# EAGLE design Board (EAGLE 7.5.0)
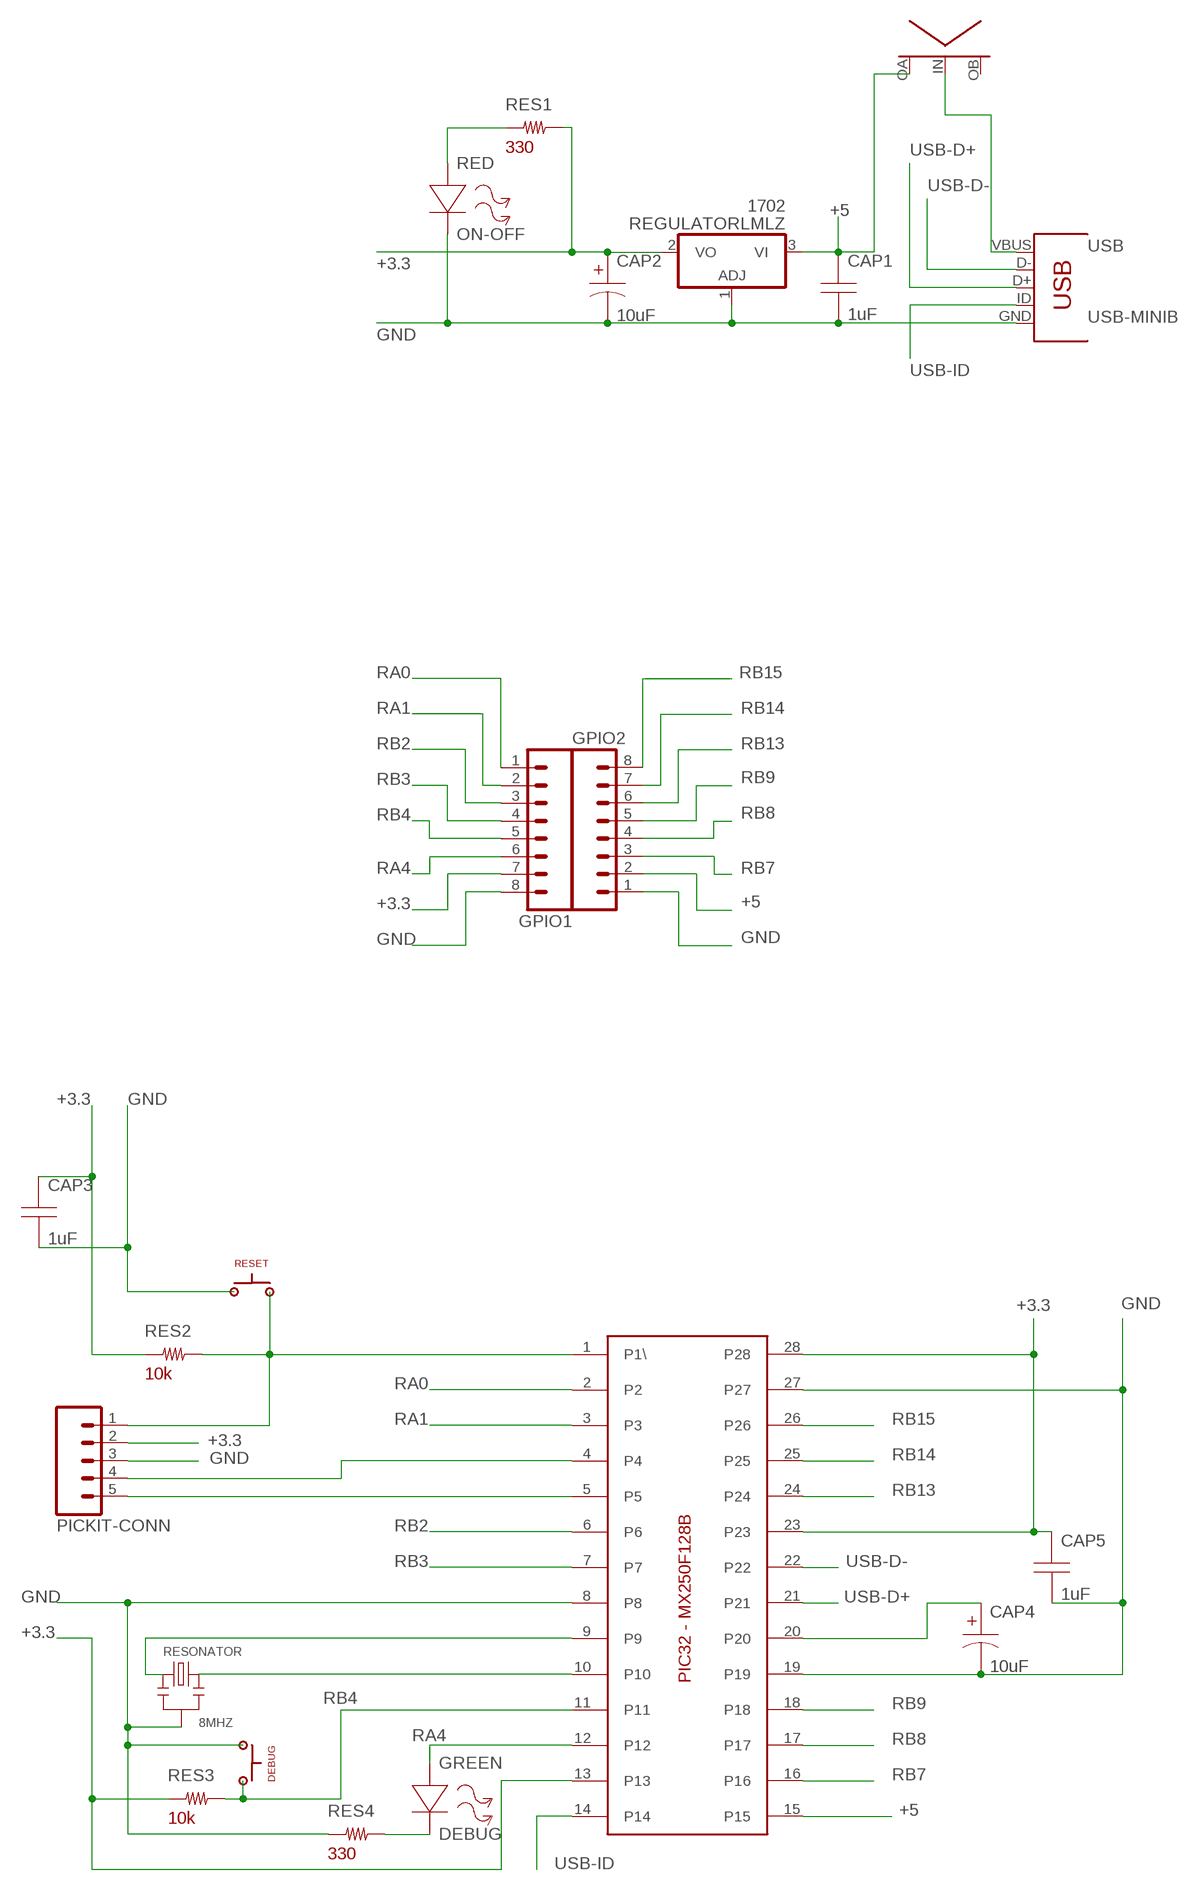
[diagram p0: schematic, sheet 1]

## Parts
1702  REGULATORLMLZ  [TO92]
CAP1  1uF  CAP-CERAMIC  [CAP-CERAMIC]
CAP2  10uF  CAP-TANTALUM  [TT2D4]
CAP3  1uF  CAP-CERAMIC  [CAP-CERAMIC]
CAP4  10uF  CAP-TANTALUM  [TT2D4]
CAP5  1uF  CAP-CERAMIC  [CAP-CERAMIC]
DEBUG  BUTTON  [PUSH5]
GPIO1  M08  [1X08_ROUND]
GPIO2  M08  [1X08_ROUND]
GREEN  DEBUG  LED  [LED]
PIC32-MX250F128B  PIC32-MX250F128B  [DIL28-3]
PICKIT-CONN  CONNECTOR-5PINPTH  [CONNECTOR-5PIN]
RED  ON-OFF  LED  [LED]
RES1  330  RESISTOR  [RESISTOR-7MM]
RES2  10k  RESISTOR  [RESISTOR-7MM]
RES3  10k  RESISTOR  [RESISTOR-7MM]
RES4  330  RESISTOR  [RESISTOR-7MM]
RESET  BUTTON  [PUSH5]
RESONATOR  8MHZ  OSCILATOR-CRYSTAL  [OSCILATOR-CRYSTAL]
U$1  SWITCH  [SWITCH]
USB  USB-MINIB  [USB-MB-H]

## Nets
+3.3: 1702.2(VO) CAP2.+ CAP3.1(A) CAP5.1(A) GPIO1.7 PIC32-MX250F128B.13 PIC32-MX250F128B.23 PIC32-MX250F128B.28 PICKIT-CONN.2 RES1.2 RES2.1 RES3.1
+5: 1702.3(VI) CAP1.1(A) GPIO2.2 PIC32-MX250F128B.15 U$1.OA
GND: 1702.1(ADJ) CAP1.2(B) CAP2.- CAP3.2(B) CAP4.- CAP5.2(B) DEBUG.1 GPIO1.8 GPIO2.1 PIC32-MX250F128B.8 PIC32-MX250F128B.19 PIC32-MX250F128B.27 PICKIT-CONN.3 RED.- RES4.1 RESET.1 RESONATOR.2 USB.GND
N$1: PIC32-MX250F128B.10 RESONATOR.3
N$2: PIC32-MX250F128B.9 RESONATOR.1
N$3: RED.+ RES1.1
N$4: PIC32-MX250F128B.4 PICKIT-CONN.4
N$5: CAP4.+ PIC32-MX250F128B.20
N$6: GREEN.- RES4.2
N$7: PIC32-MX250F128B.1(P1\) PICKIT-CONN.1 RES2.2 RESET.2
N$8: U$1.IN USB.VBUS
N$9: PIC32-MX250F128B.5 PICKIT-CONN.5
RA0: GPIO1.1 PIC32-MX250F128B.2
RA1: GPIO1.2 PIC32-MX250F128B.3
RA4: GPIO1.6 GREEN.+ PIC32-MX250F128B.12
RB2: GPIO1.3 PIC32-MX250F128B.6
RB3: GPIO1.4 PIC32-MX250F128B.7
RB4: DEBUG.2 GPIO1.5 PIC32-MX250F128B.11 RES3.2
RB7: GPIO2.3 PIC32-MX250F128B.16
RB8: GPIO2.4 PIC32-MX250F128B.17
RB9: GPIO2.5 PIC32-MX250F128B.18
RB13: GPIO2.6 PIC32-MX250F128B.24
RB14: GPIO2.7 PIC32-MX250F128B.25
RB15: GPIO2.8 PIC32-MX250F128B.26
USB-D+: PIC32-MX250F128B.21 USB.D+
USB-D-: PIC32-MX250F128B.22 USB.D-
USB-ID: PIC32-MX250F128B.14 USB.ID
Unconnected: U$1.OB

## Library data of the parts
1702 = 433:REGULATOR: Positive VOLTAGE REGULATOR
CAP1 CAP3 CAP5 = 433:CAP-CERAMIC
CAP2 CAP4 = 433:CAP-TANTALUM
DEBUG RESET = 433:BUTTON
GPIO1 GPIO2 = 433:M08: Header 8 Standard 8-pin 0.1" header. Use with straight break away headers (SKU : PRT-00116), right angle break away headers (PRT-00553), swiss pins (PRT-00743), machine pins (PRT-00117), and female headers (PRT-00115).; PROD_ID: CONN-08437
GREEN RED = 433:LED
PIC32-MX250F128B = 433:PIC32-MX250F128B
PICKIT-CONN = 433:CONNECTOR-5PIN: Header 5 Standard 5-pin 0.1" header. Use with straight break away headers (SKU : PRT-00116), right angle break away headers (PRT-00553), swiss pins (PRT-00743), machine pins (PRT-00117), and female headers (PRT-00115). Molex polarized connector foot print use with SKU : PRT-08230 with associated crimp pins and housings.
RES1-RES4 = 433:RESISTOR
RESONATOR = 433:OSCILATOR-CRYSTAL: 306030010; MPN: CSTLS8M00G53Z-A0
U$1 = 433:SWITCH
USB = 433:USB-MINIB: Mini-USB "B" connector with 5th pin broken out. Created new symbol breaking out 5th "ID" pin in mini/micro USB connector spec. See: http://en.wikipedia.org/wiki/Mini_usb#Cables. Uses same footprint as 4-pin symbol. Also added pins to connect to mounting / shield pads if required (probably not generally needed as signals aren't shielded once they leave the connector).

## Board
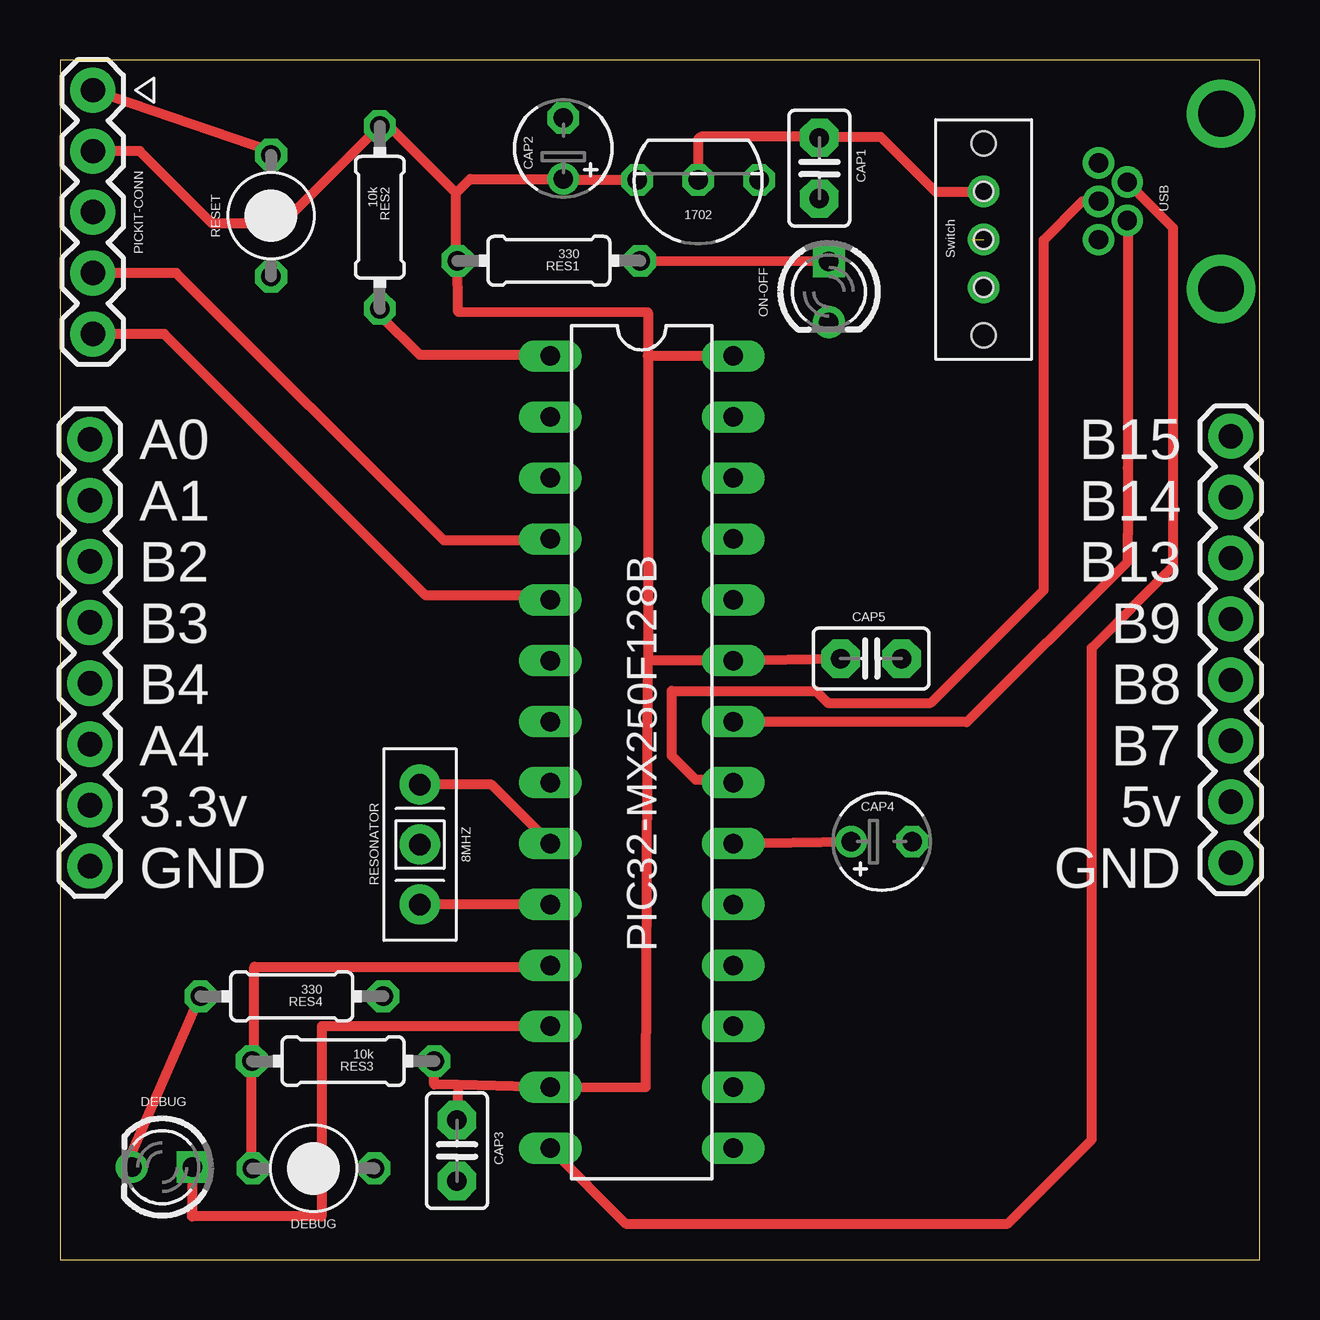
[diagram p1: board, top side]
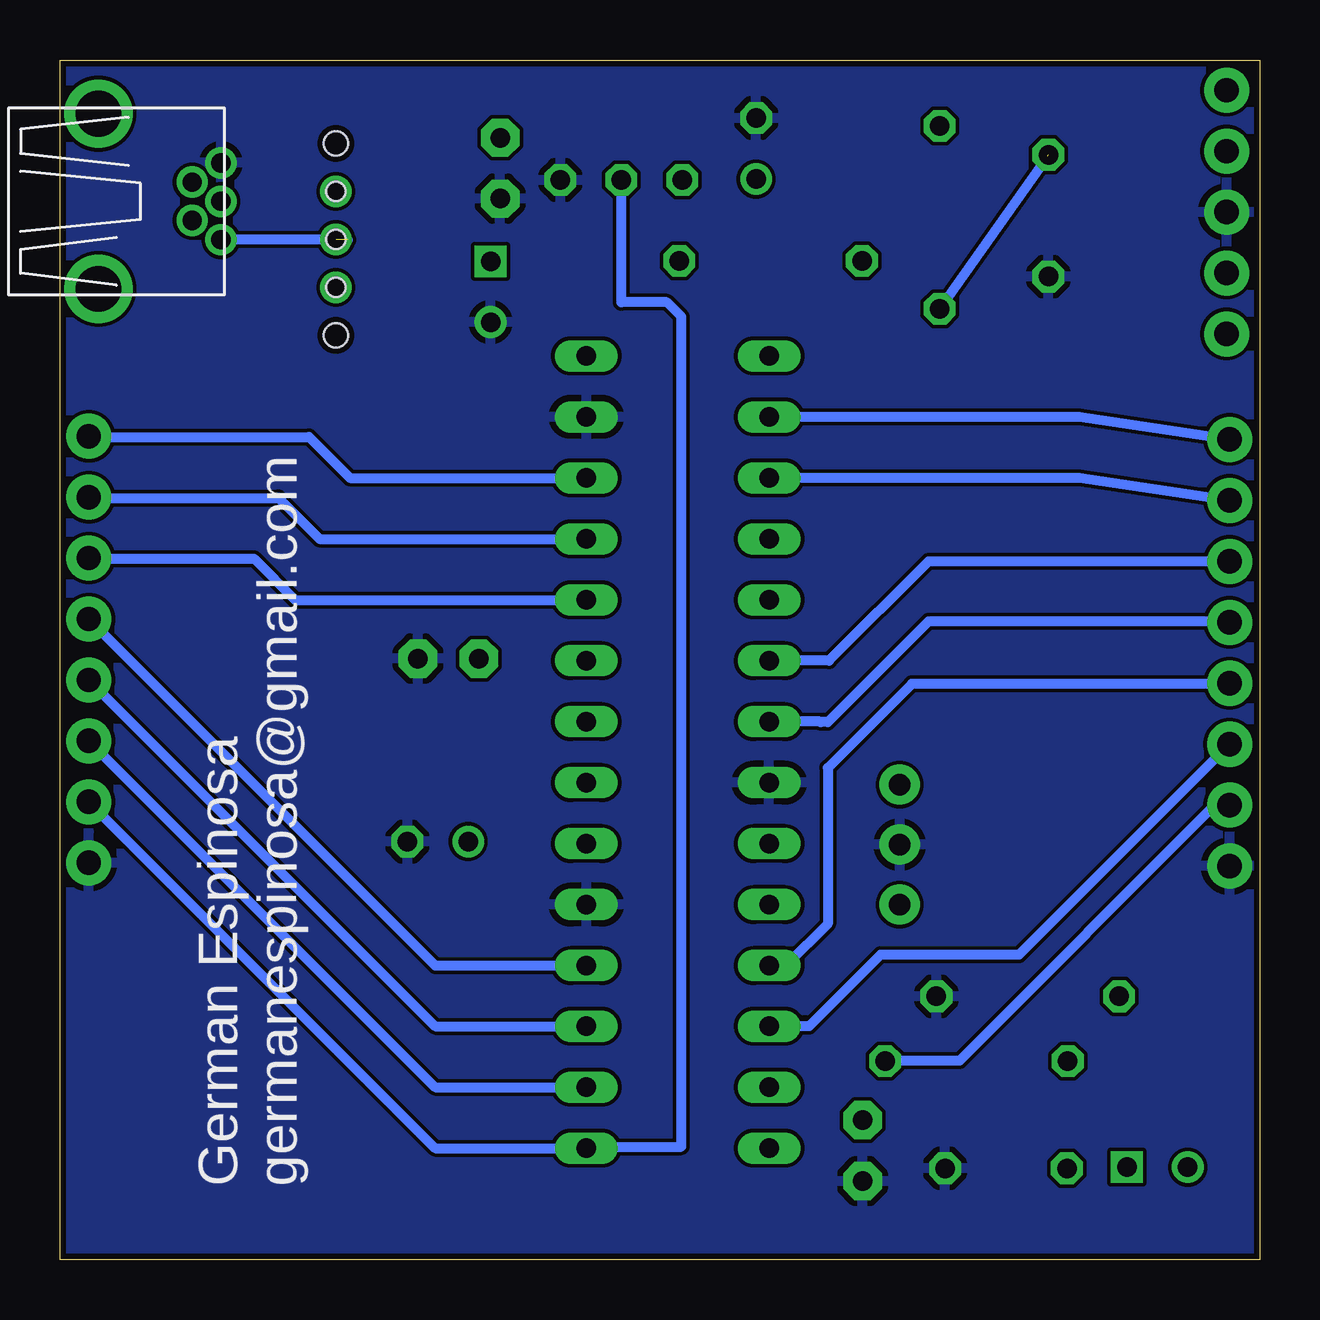
[diagram p2: board, bottom side, seen from below]

Size 50 x 50 mm. Coordinates in mm from the lower left corner, seen from the top.
Outline: 0,0 50,0 50,50 0,50 0,0
Copper layers (1*16): Top 0.035mm / dielectric 1.5mm / Bottom 0.035mm
Design rules "SeeedStudio_2layer_DRU_no_angle_20140221": minimum track width 6mil, minimum drill 12mil, track to track 6mil, track to pad 6mil, pad to pad 6mil, via to via 6mil, smd to smd 0mil, copper to edge 10mil, drill to drill 10mil, minimum pad ring 10mil, minimum via ring 6mil, stop-mask expansion 2mil, vias tented up to drill 100mil, thermal gap 10mil

### Footprints (pad centres in the part's own frame; a part is rotated, then mirrored left to right if it is on the bottom)
TO92 = drill 0.813 octagon: 1 -2.54,0; 2 2.54,0; 3 0,0
CAP-CERAMIC = drill 0.813 pad 1.6 octagon: 1 -1.27,0; 2 1.27,0
TT2D4 = drill 0.813: + -1.27,0 | drill 0.813 octagon: - 1.27,0
PUSH5 = drill 0.813 octagon: 1 -2.54,0; 2 2.54,0
1X08_ROUND = drill 1.016 pad 1.88: 1 0,0; 2 2.54,0; 3 5.08,0; 4 7.62,0; 5 10.16,0; 6 12.7,0; 7 15.24,0; 8 17.78,0
LED = drill 0.813 square: + -1.27,0 | drill 0.813: - 1.27,0
DIL28-3 = drill 0.813 long: 1 -16.51,-3.81; 2 -13.97,-3.81; 3 -11.43,-3.81; 4 -8.89,-3.81; 5 -6.35,-3.81; 6 -3.81,-3.81; 7 -1.27,-3.81; 8 1.27,-3.81; 9 3.81,-3.81; 10 6.35,-3.81; 11 8.89,-3.81; 12 11.43,-3.81; 13 13.97,-3.81; 14 16.51,-3.81; 15 16.51,3.81; 16 13.97,3.81; 17 11.43,3.81; 18 8.89,3.81; 19 6.35,3.81; 20 3.81,3.81; 21 1.27,3.81; 22 -1.27,3.81; 23 -3.81,3.81; 24 -6.35,3.81; 25 -8.89,3.81; 26 -11.43,3.81; 27 -13.97,3.81; 28 -16.51,3.81
CONNECTOR-5PIN = drill 1.016 pad 1.88: 1 0,0; 2 2.54,0; 3 5.08,0; 4 7.62,0; 5 10.16,0
RESISTOR-7MM = drill 0.813 octagon: 1 -3.81,0; 2 3.81,0
OSCILATOR-CRYSTAL = drill 0.9 pad 1.676: 1 2.5,0; 2 0,0; 3 -2.5,0
SWITCH = drill 0.8: IN 0,0; OA 2,0; OB -2,0 | hole 1: -4,0; 4,0 | hole 0.8: 2,0; 0,0; -2,0
USB-MB-H = drill 0.8: D+ 5.1,0; D- 3.9,0.8; GND 5.1,-1.6; ID 3.9,-0.8; VBUS 5.1,1.6 | drill 1.9: P$6 0,-3.65; P$7 0,3.65

### Placement (x,y rotation side)
1702  26.6,45 180 top
CAP1  31.65,45.49 270 top
CAP2  20.98,46.31 90 top
CAP3  16.55,4.54 270 top
CAP4  34.25,17.42 0 top
CAP5  33.81,25.05 0 top
DEBUG  10.57,3.8 180 top
GPIO1  1.25,34.18 270 top
GPIO2  48.8,16.54 90 top
GREEN  4.26,3.85 180 top
PIC32-MX250F128B  24.25,21.15 270 top
PICKIT-CONN  1.37,48.74 270 top
RED  32.05,40.34 270 top
RES1  20.38,41.63 180 top
RES2  13.33,43.44 270 top
RES3  11.8,8.27 180 top
RES4  9.66,10.97 180 top
RESET  8.8,43.51 90 top
RESONATOR  15,17.3 90 top
U$1  38.5,42.52 90 top
USB  48.39,44.11 180 top

### Tracks (layer width: path | path; a pad name or v marks a point on that pad's centre or on a via)
+3.3
  Top 0.406: 1702.2 20.98,45 CAP2.+ 17.1,45.04 16.51,44.45 | 24.5,37.66 24.5,39.47 16.6,39.5 RES1.2 16.51,41.69 16.51,44.45 | 24.5,37.66 24.5,24.96 | 24.5,24.96 PIC32-MX250F128B.23 CAP5.1 | PIC32-MX250F128B.28 24.5,37.66 | 24.5,24.96 24.42,7.19 PIC32-MX250F128B.13 16.61,7.28 | 16.55,5.78 CAP3.1 | CAP3.1 16.61,5.81 | 13.33,47.2 RES2.1 | 16.61,7.28 15.6,7.3 RES3.1 | CAP3.1 16.61,7.28 | RES2.1 9.26,43.18 6.35,43.18 3.33,46.2 PICKIT-CONN.2 | 16.51,44.45 13.71,47.25 RES2.1
  Bottom 0.406: RES3.1 15.58,8.3 12.5,8.3 1.86,18.94 GPIO1.7
+5
  Top 0.406: 1702.3 26.6,46.7 26.7,46.8 31.31,46.8 CAP1.1 31.39,46.8 34.2,46.8 36.48,44.52 U$1.OA
  Bottom 0.406: 1702.3 26.6,39.9 24.7,39.9 24.1,39.3 24.1,4.7 28,4.7 PIC32-MX250F128B.15 34.36,4.64 GPIO2.2
GND
  pour Bottom: 0,50 50,50 50,0 0,0
N$1
  Top 0.406: PIC32-MX250F128B.10 RESONATOR.3
N$2
  Top 0.406: PIC32-MX250F128B.9 17.98,19.8 RESONATOR.1
N$3
  Top 0.406: RED.+ RES1.1
N$4
  Top 0.406: PIC32-MX250F128B.4 20.37,29.97 16,29.97 4.85,41.12 PICKIT-CONN.4
N$5
  Top 0.406: PIC32-MX250F128B.20 CAP4.+
N$6
  Top 0.406: GREEN.- 2.73,3.85 RES4.2
N$7  (1 unrouted)
  Top 0.406: PICKIT-CONN.1 8.8,46.2 RESET.2 | 13.4,39.63 RES2.2 13.33,39.37 15,37.7 20.4,37.7 PIC32-MX250F128B.1
  Bottom 0.406: 8.83,46 RES2.2
N$8  (1 unrouted)
  Bottom 0.406: 38,42.51 USB.VBUS
N$9
  Top 0.406: PIC32-MX250F128B.5 20.25,27.69 15.24,27.69 4.35,38.58 PICKIT-CONN.5
RA0
  Bottom 0.406: GPIO1.1 7.52,35.12 PIC32-MX250F128B.2
RA1
  Bottom 0.406: GPIO1.2 7.52,32.58 PIC32-MX250F128B.3
RA4
  Top 0.406: PIC32-MX250F128B.12 10.91,9.72 10.9,1.8 5.5,1.8 5.5,2 5.53,2 GREEN.+
  Bottom 0.406: GPIO1.6 10.03,12.7 15.8,12.7 18.78,9.72 PIC32-MX250F128B.12
RB2
  Bottom 0.406: GPIO1.3 13.8,29.1 17.94,24.96 PIC32-MX250F128B.6
RB3
  Top 0.406: PIC32-MX250F128B.7 20.36,22.5
  Bottom 0.406: GPIO1.4 1.29,26.6 13.8,26.6 18,22.4 18.3,22.4 18.32,22.42 PIC32-MX250F128B.7
RB4
  Top 0.406: DEBUG.2 7.99,3.8 RES3.2 8.1,8.27 8.1,12.2 20.74,12.2 PIC32-MX250F128B.11
  Bottom 0.406: GPIO1.5 1.27,24 14.5,24 18,20.5 18,14 19.74,12.26 PIC32-MX250F128B.11
RB7
  Bottom 0.406: GPIO2.3 34.36,7.18 PIC32-MX250F128B.16
RB8
  Bottom 0.406: GPIO2.4 34.36,9.72 PIC32-MX250F128B.17
RB9
  Bottom 0.406: GPIO2.5 34.36,12.26 PIC32-MX250F128B.18
RB13
  Bottom 0.406: GPIO2.6 48.77,29.21 41.91,29.21 40.2,27.5 PIC32-MX250F128B.24
RB14
  Bottom 0.406: GPIO2.7 48.77,31.75 40.89,31.75 39.18,30.04 PIC32-MX250F128B.25
RB15
  Bottom 0.406: GPIO2.8 48.77,34.29 39.62,34.29 37.91,32.58 PIC32-MX250F128B.26
USB-D+
  Top 0.406: PIC32-MX250F128B.21 27.94,20 26.5,20 25.5,21 25.5,23.7 31.5,23.7 32,23.2 36.3,23.2 41,27.9 41,42.5 42.61,44.11 USB.D+
USB-D-
  Top 0.406: USB.D- 44.5,33 44.5,30.2 44.5,29.1 37.8,22.4 27.98,22.4 PIC32-MX250F128B.22
USB-ID
  Top 0.406: USB.ID 46.4,42.99 46.4,28.9 43,25.5 43,5 39.5,1.5 23.58,1.5 PIC32-MX250F128B.14

### Text on the board
tPlace: A0 / A1 / B2 / B3 / B4 / A4 / 3.3v / GND | B15 / B14 / B13 / B9 / B8 / B7 / 5v / GND
bPlace: German Espinosa / germanespinosa@gmail.com